# Altium schematic sheet main.SchDoc
size 209 x 297 mm; PageSetup: Record=PageOptions|CenterHorizontal=False|CenterVertical=False|PrintScale=1.00|XCorrection=0.00|YCorrection=0.00|PrintKind=0|BorderSize=5000000|LeftOffset=0|BottomOffset=0|Orientation=2|PaperLength=1000|PaperWidth=1000|Scale=100|PaperSource=15|PrintQuality=-3|MediaType=1|DitherType=10|PrintScaleMode=0|PaperKind=A3|PaperIndex=8; TitleBlock_01a_DocumentName_line1: BoM Converter; TitleBlock_01a_DocumentName_line2: отладочный проект AD; TitleBlock_01b_DocumentType_line1: Схема электрическая; TitleBlock_01b_DocumentType_line2: принципиальная; TitleBlock_02_DocumentDesignator: BCAD.123456.001 Э3; TitleBlock_07_SheetNumber: 1; TitleBlock_08_SheetTotal: 5; TitleBlock_09_Organization: ООО "НИИ БАЦА"; TitleBlock_11a_Name_Designer: Иванов И.И.; TitleBlock_11b_Name_Checker: Петров П.П.; TitleBlock_11c_Name_TechnicalSupervisor: Сидоров С.С.; TitleBlock_11e_Name_NormativeSupervisor: Зюзина В.Н.; TitleBlock_11f_Name_Approver: Горшков А.С.; TitleBlock_13a_SignatureDate_Designer: 07.10.22; TitleBlock_13b_SignatureDate_Checker: 07.10.22; TitleBlock_13c_SignatureDate_TechnicalSupervisor: 07.10.22; TitleBlock_13e_SignatureDate_NormativeSupervisor: 07.10.22; TitleBlock_13f_SignatureDate_Approver: 07.10.22
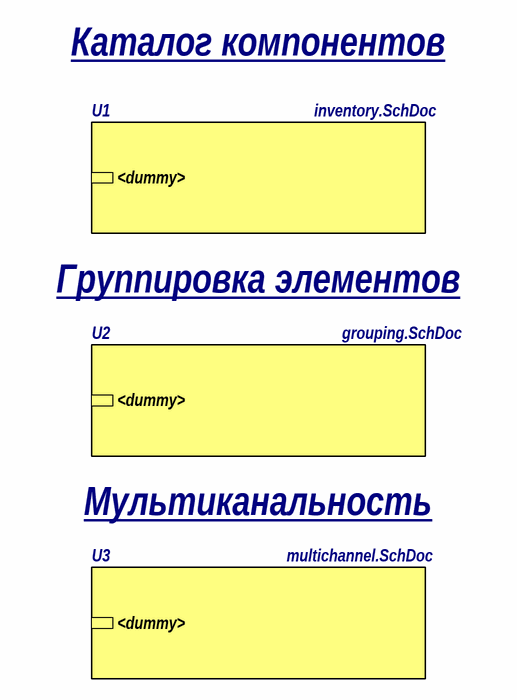
[diagram p0: main.SchDoc]

## Sub-sheets
U1 = inventory.SchDoc: <dummy>
U2 = grouping.SchDoc: <dummy>
U3 = multichannel.SchDoc: <dummy>

## Notes on the sheet
- Каталог компонентов
- Группировка элементов
- Мультиканальность
- Перв. примен.
- Справ. №
- Подп. и дата
- Инв. № дубл.
- Взам. инв. №
- Разраб.
- Изм.
- Лист
- № докум.
- Подп.
- Дата
- Лит.
- Масса
- Масштаб
- Т.контр.
- Пров.
- Листов
- Инв. № подл.
- Утв.
- Н.контр.
- Копировал
- Формат А4